# EasyEDA schematic SCH_led+transistor_2026-04-28.json
TITLE: Sheet_1; REV: 1.0; Date: 2026-04-28; Sheet: 1/1; Drawn By: kristina112; Company: Your Company
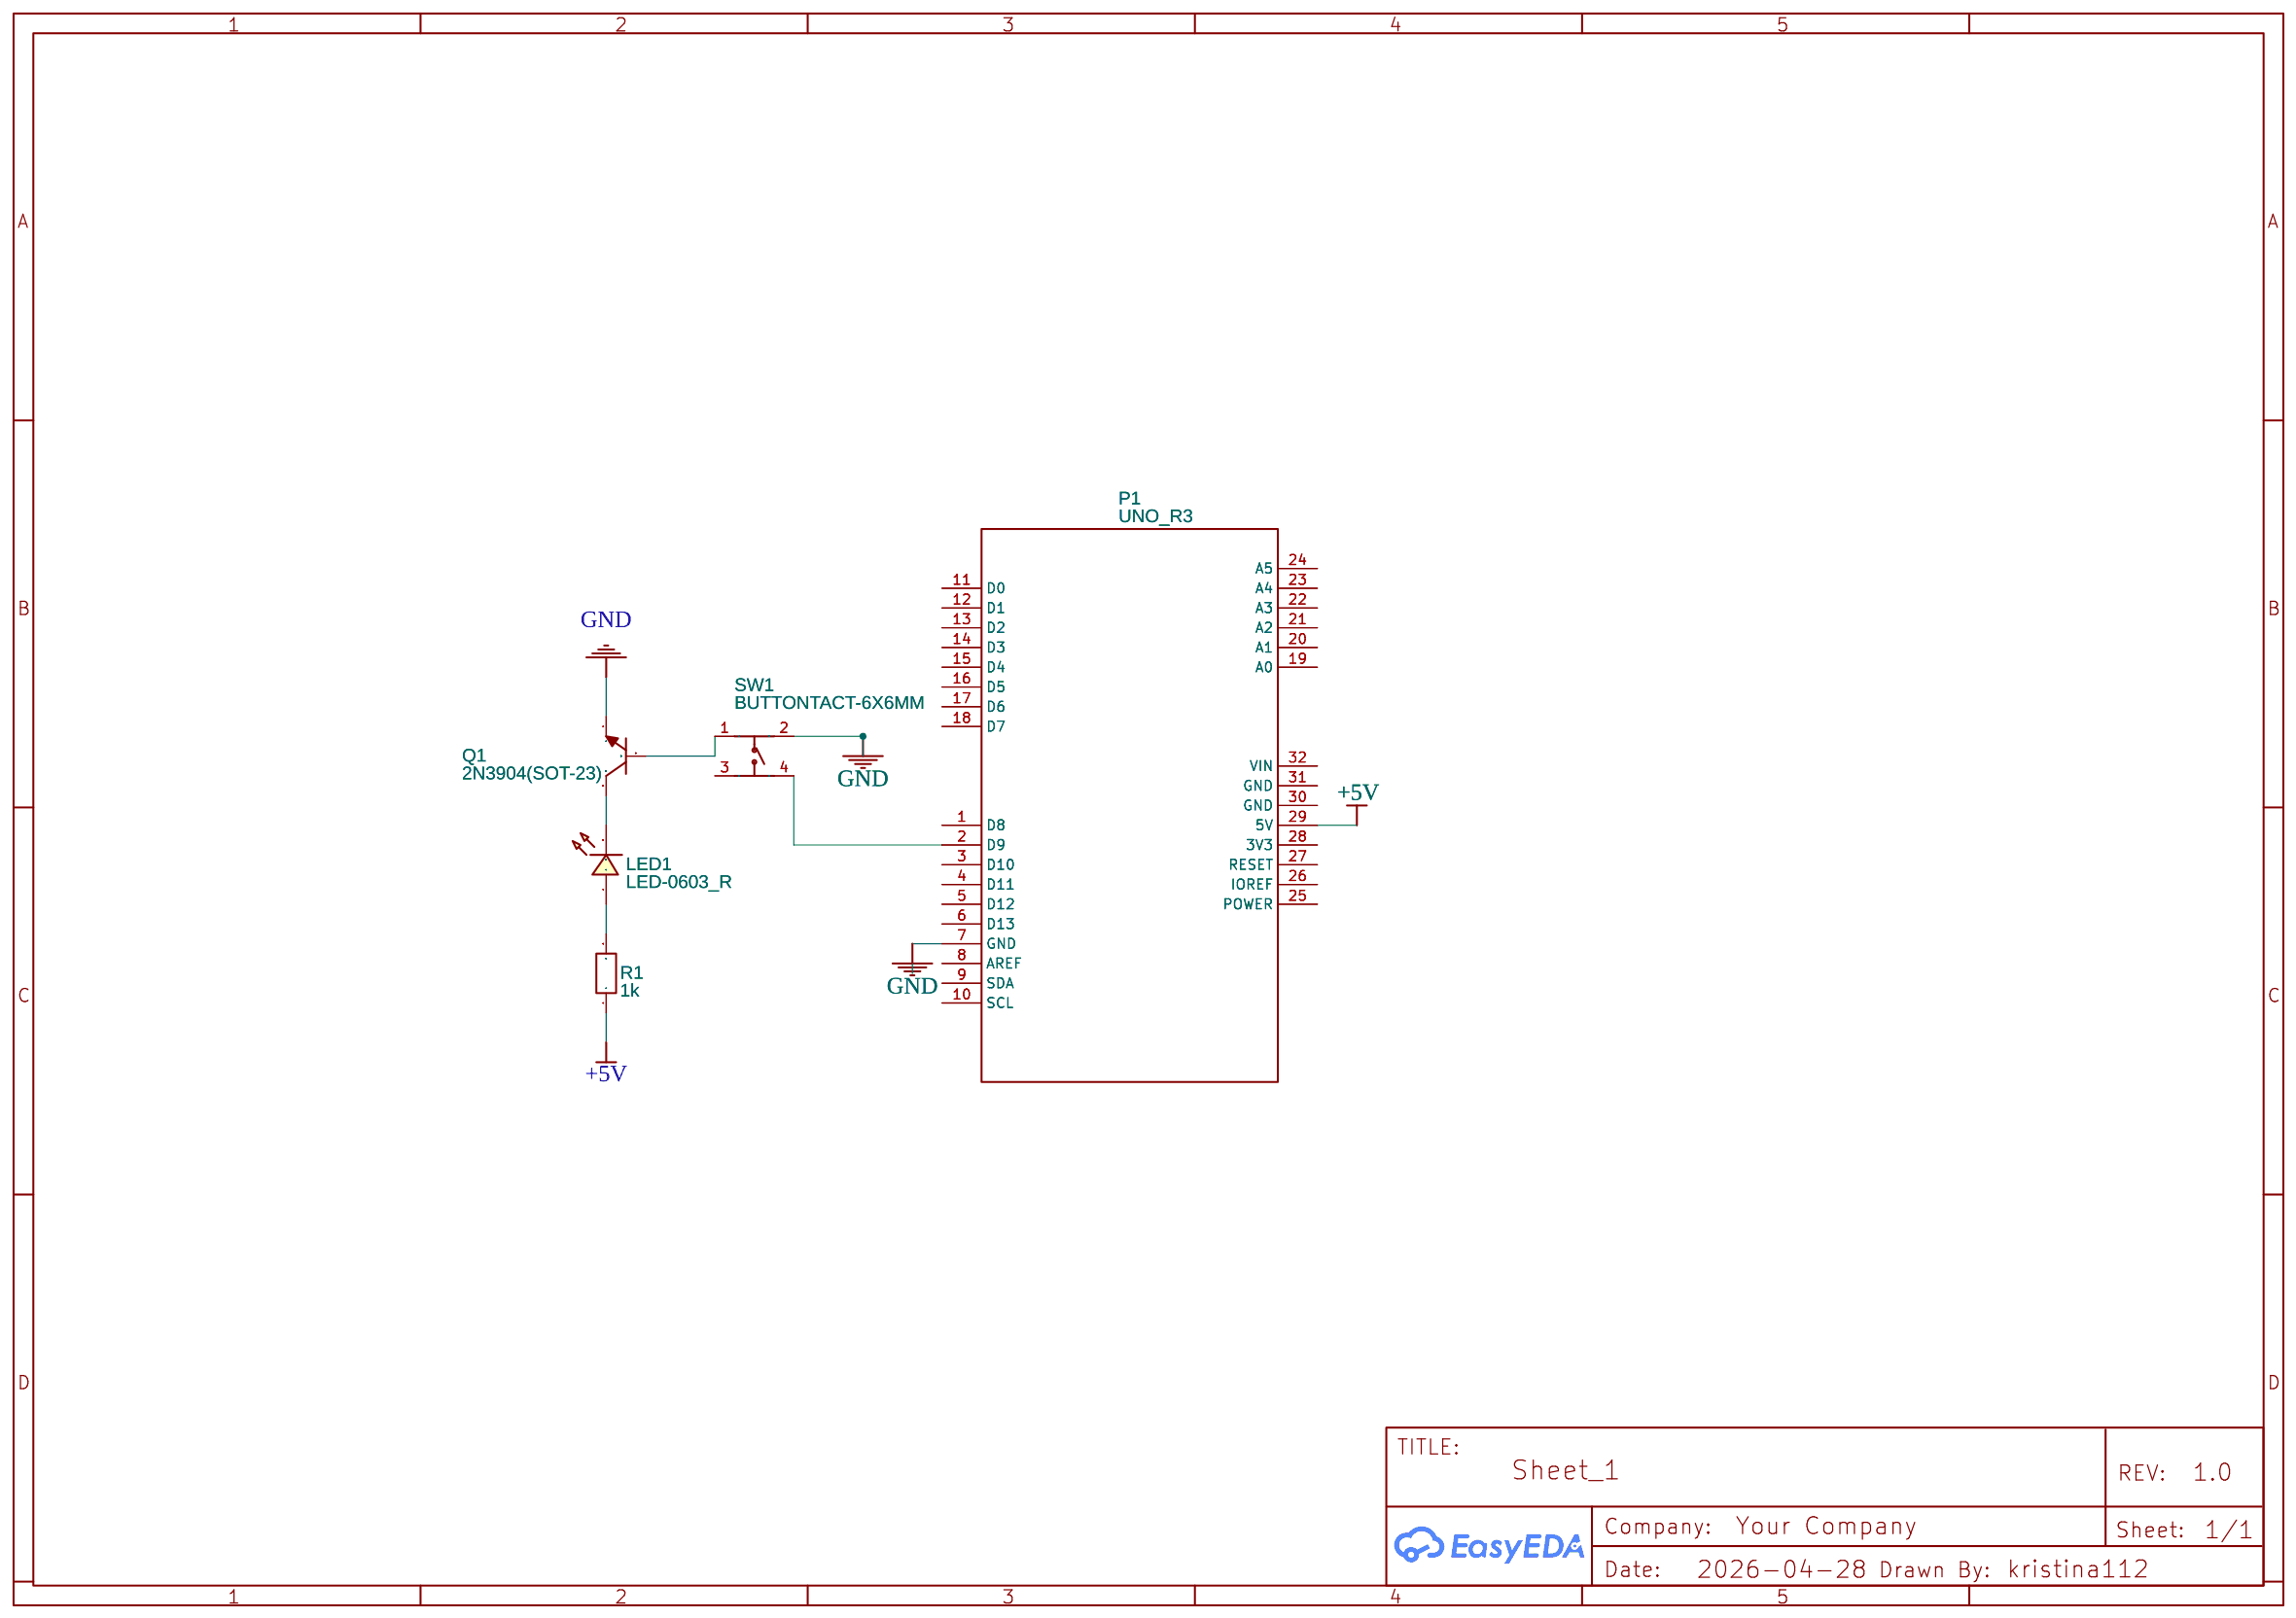
[diagram p0: schematic sheet]

## Parts
LED1  LED-0603_R  [LED0603_RED]
P1  UNO_R3  [UNO_R3]
Q1  2N3904(SOT-23)  [SOT-23-3_L2.9-W1.3-P1.90-LS2.4-TR]
R1  1k  [R0603]
SW1  BUTTONTACT-6X6MM  [SW-SMD_4P-L6.0-W6.0-P4.50-LS9.2]

## Library data of the parts
LED1 = LED-0603_R: Manufacturer: EVERLIGHT(台湾亿光); Manufacturer Part: 19-217/R6C-AL1M2VY/3T; Supplier Part: C72044; Supplier: LCSC; Contributor: LCEDA_01
P1 = UNO_R3: sourceId: 1T5FDZYC8
Q1 = 2N3904(SOT-23): Supplier: LCSC; Manufacturer: KEC; Manufacturer Part: 2n3904S-RTK/PS; Supplier Part: C18536; Paste Type: SOT-23; Contributor: LCEDA_Lib
R1 = R_0603_EU: Contributor: LCEDA_Lib
SW1 = BUTTONTACT-6X6MM: Contributor: LCSC; Supplier: LCSC; Supplier Part: C9900004221; Manufacturer Part: Buttontact-6x6mm; Manufacturer: null; JLCPCB Part Class: Extended Part

## Nets
+5V: P1.29(5V) R1.1
GND: P1.7(GND) Q1.1(E) SW1.2(B)
Net-(LED1-1): LED1.1 R1.2
Net-(LED1-2): LED1.2 Q1.3(C)
Net-(P1-2): P1.2(D9) SW1.4(D)
Net-(Q1-2): Q1.2(B) SW1.1(A)

Not connected (* = marked no-connect by the designer): P1 1(D8) 3(D10) 4(D11) 5(D12) 6(D13) 8(AREF) 9(SDA) 10(SCL) 11(D0) 12(D1) 13(D2) 14(D3) 15(D4) 16(D5) 17(D6) 18(D7) 19(A0) 20(A1) 21(A2) 22(A3) 23(A4) 24(A5) 25(POWER) 26(IOREF) 27(RESET) 28(3V3) 30(GND) 31(GND) 32(VIN); SW1 3(C)
